# Altium schematic sheet NUDGE_PCB_V1R0.SchDoc
size A4; Engineer: Irshath Ali Syed; DocumentNumber: NUDGE-SCH-00; Revision: v0.1; SheetNumber: 1; SheetTotal: 4; SheetTitle: NUDGE - Block Diagram
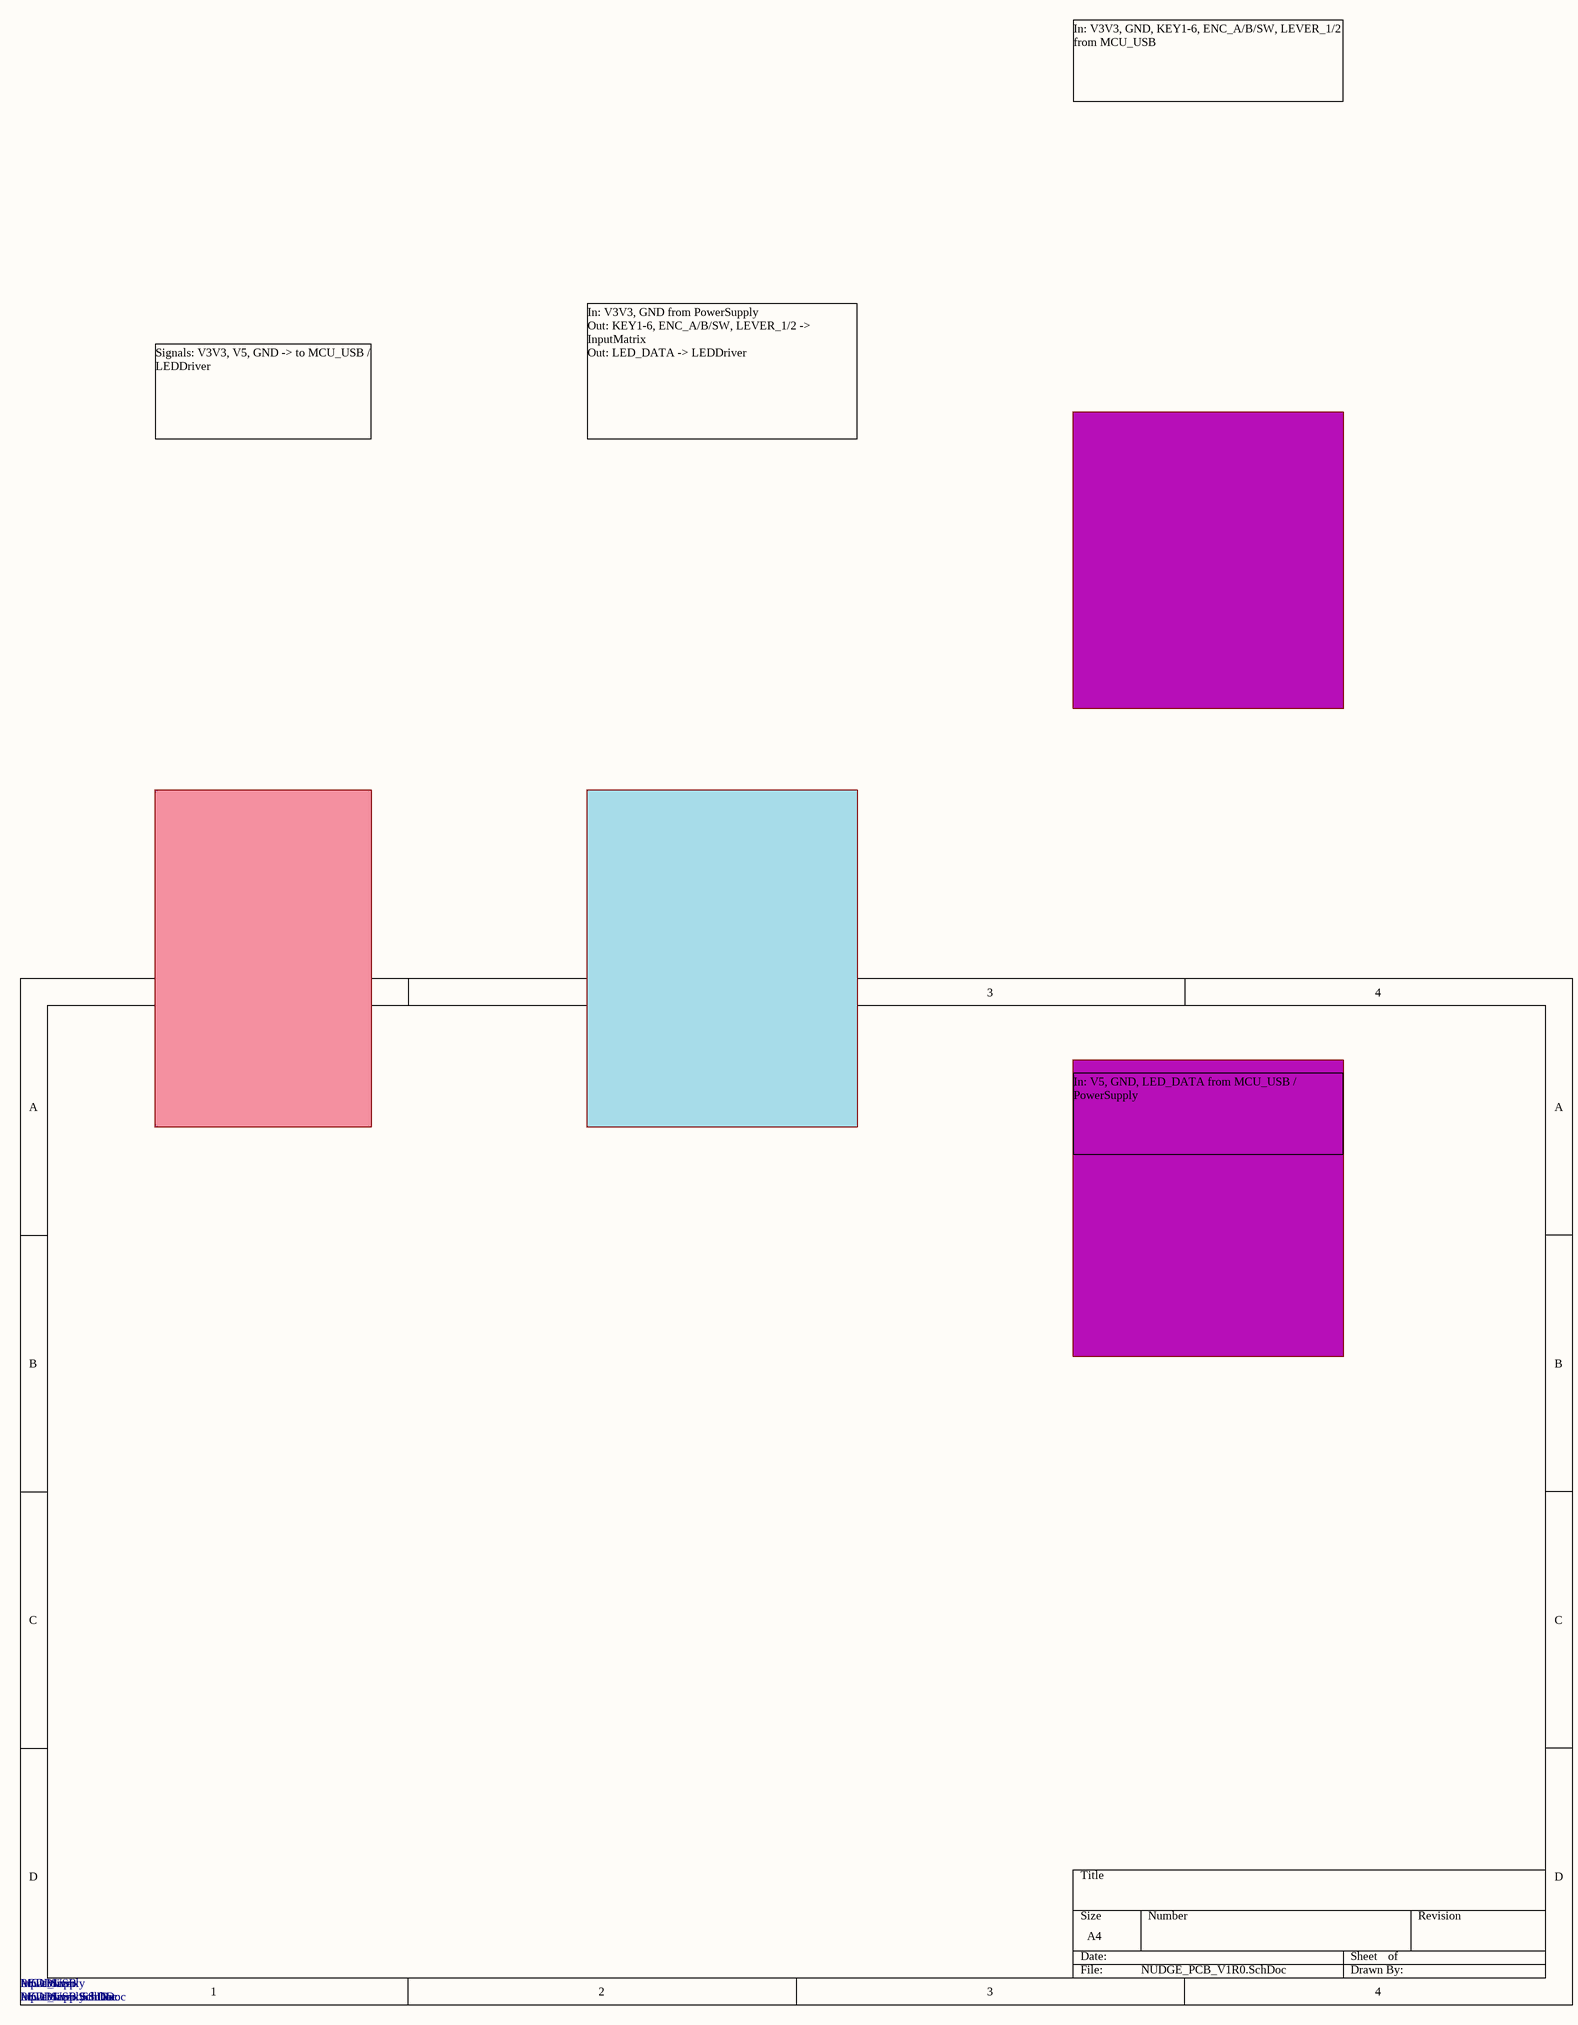
[diagram p0: NUDGE_PCB_V1R0.SchDoc]

## Sub-sheets
InputMatrix = InputMatrix.SchDoc: no entries
LEDDriver = LEDDriver.SchDoc: no entries
MCU_USB = MCU_USB.SchDoc: no entries
PowerSupply = PowerSupply.SchDoc: no entries

## Notes on the sheet
- In: V3V3, GND, KEY1-6, ENC_A/B/SW, LEVER_1/2 from MCU_USB
- Signals: V3V3, V5, GND -> to MCU_USB / LEDDriver
- In: V3V3, GND from PowerSupply
  Out: KEY1-6, ENC_A/B/SW, LEVER_1/2 -> InputMatrix
  Out: LED_DATA -> LEDDriver
- In: V5, GND, LED_DATA from MCU_USB / PowerSupply